# EAGLE design SPIDriverSRAM_v1 (EAGLE 9.6.2)
PC Engine Joypad Breakout Version 1.0
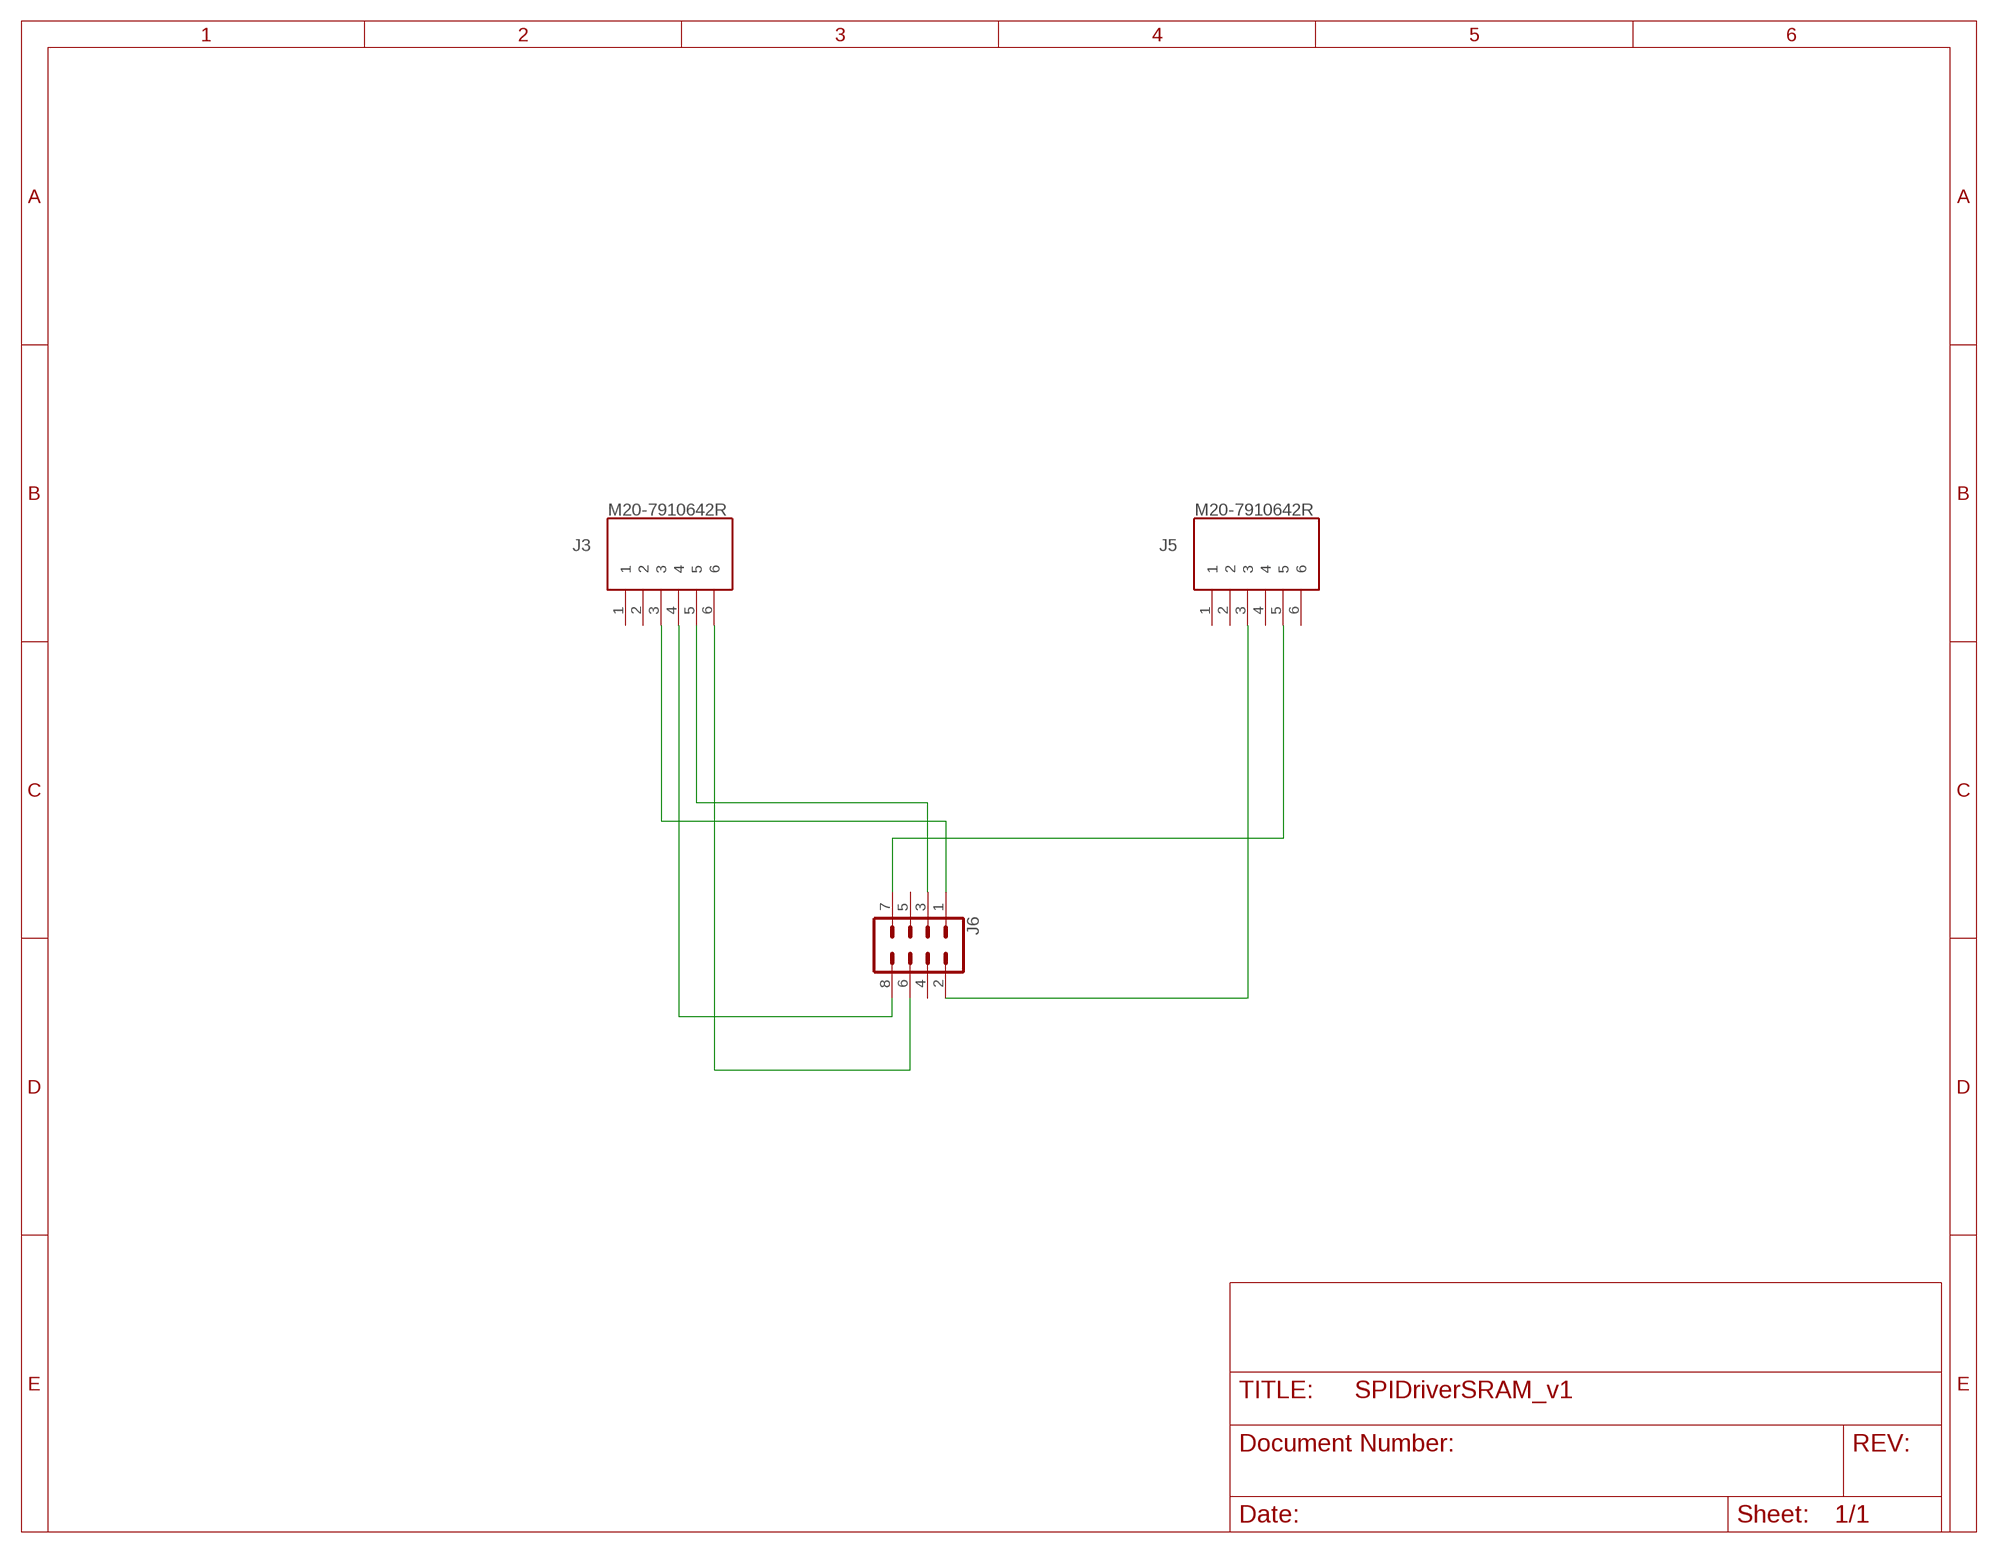
[diagram p0: schematic, sheet 1]

## Parts
J3  M20-7910642R  [M20-7910642R]
J5  M20-7910642R  [M20-7910642R]
J6  CONN_04X2  [2X4]

## Nets
N$1: J3.3 J6.1
N$2: J3.5 J6.3
N$3: J5.5 J6.7
N$4: J5.3 J6.2
N$5: J3.4 J6.8
N$6: J3.6 J6.6
Unconnected: J3.1 J3.2 J5.1 J5.2 J5.4 J5.6 J6.4 J6.5

## Library data of the parts
J3 J5 = PC-Engine:M20-7910642R: Headers & Wire Housings 6 WAY SIL HORIZ SMT SKT T&R Source: Datasheet <https://cdn.harwin.com/pdfs/M20-791R.pdf>; ARROW_PART_NUMBER: M20-7910642R; DESCRIPTION: Headers & Wire Housings 6 WAY SIL HORIZ SMT SKT T&R; HEIGHT: mm; MANUFACTURER_NAME: HARWIN; MANUFACTURER_PART_NUMBER: M20-7910642R; MOUSER_PART_NUMBER: 855-M20-7910642R; MOUSER_PRICE-STOCK: https://www.mouser.co.uk/ProductDetail/Harwin/M20-7910642R?qs=k41KVqW3ymovSPRowkWy%2Fg%3D%3D
J6 = SparkFun-Connectors:CONN_04X2: Multi connection point. Often used as Generic Header-pin footprint for 0.1 inch spaced/style header connections On any of the 0.1 inch spaced packages, you can populate with these: Break Away Headers - Straight <https://www.sparkfun.com/products/116> (PRT-00116) Break Away Male Headers - Right Angle <https://www.sparkfun.com/products/553> (PRT-00553) Female Headers <https://www.sparkfun.com/products/115> (PRT-00115) Break Away Headers - Machine Pin <https://www.sparkfun.com/products/117> (PRT-00117) Break Away Female Headers - Swiss Machine Pin <https://www.sparkfun.com/products/743> (PRT-00743)

## Net classes
0 default: width 0.305 mm, drill 0.356 mm, clearance 0.305 mm
1 breadboard: width 1.016 mm, drill 0.356 mm, clearance 0.305 mm
2 power: width 0.305 mm, drill 0.356 mm, clearance 0.305 mm
3 signal: width 0.152 mm, drill 0.356 mm, clearance 0.152 mm

## Board
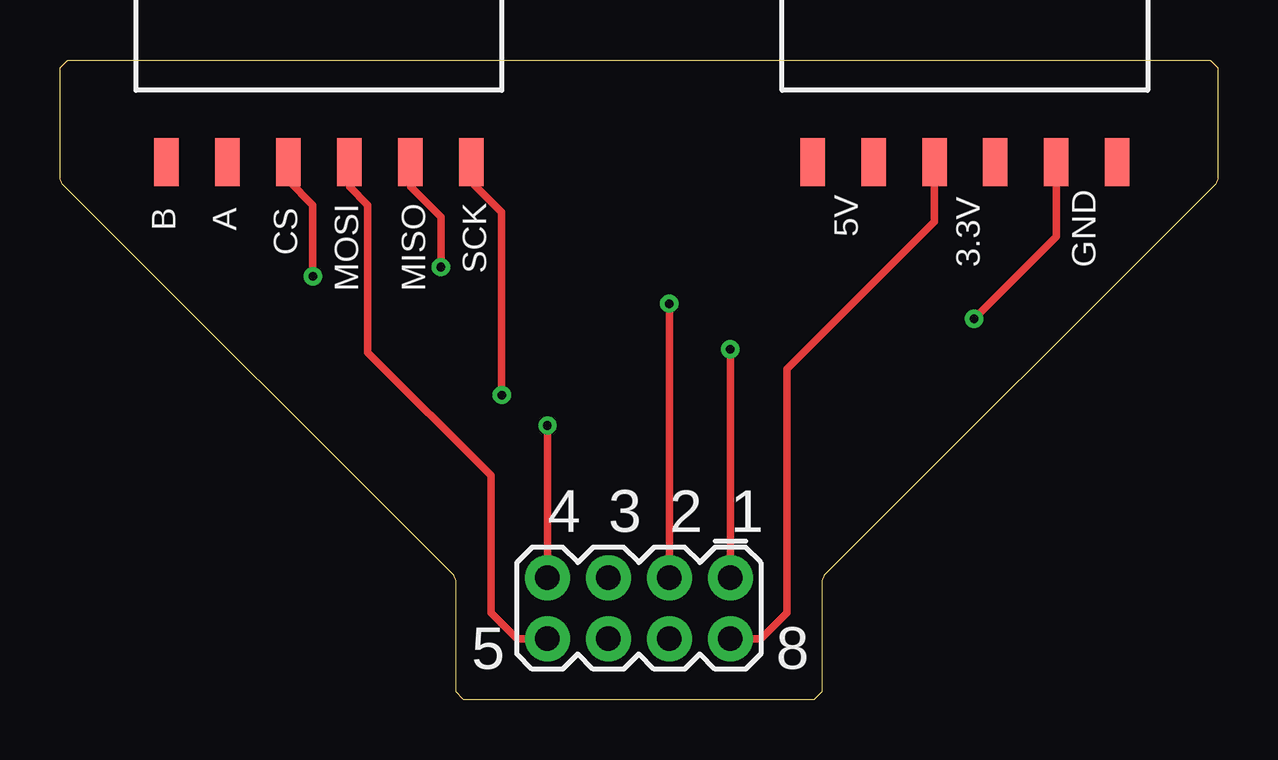
[diagram p1: board, top side]
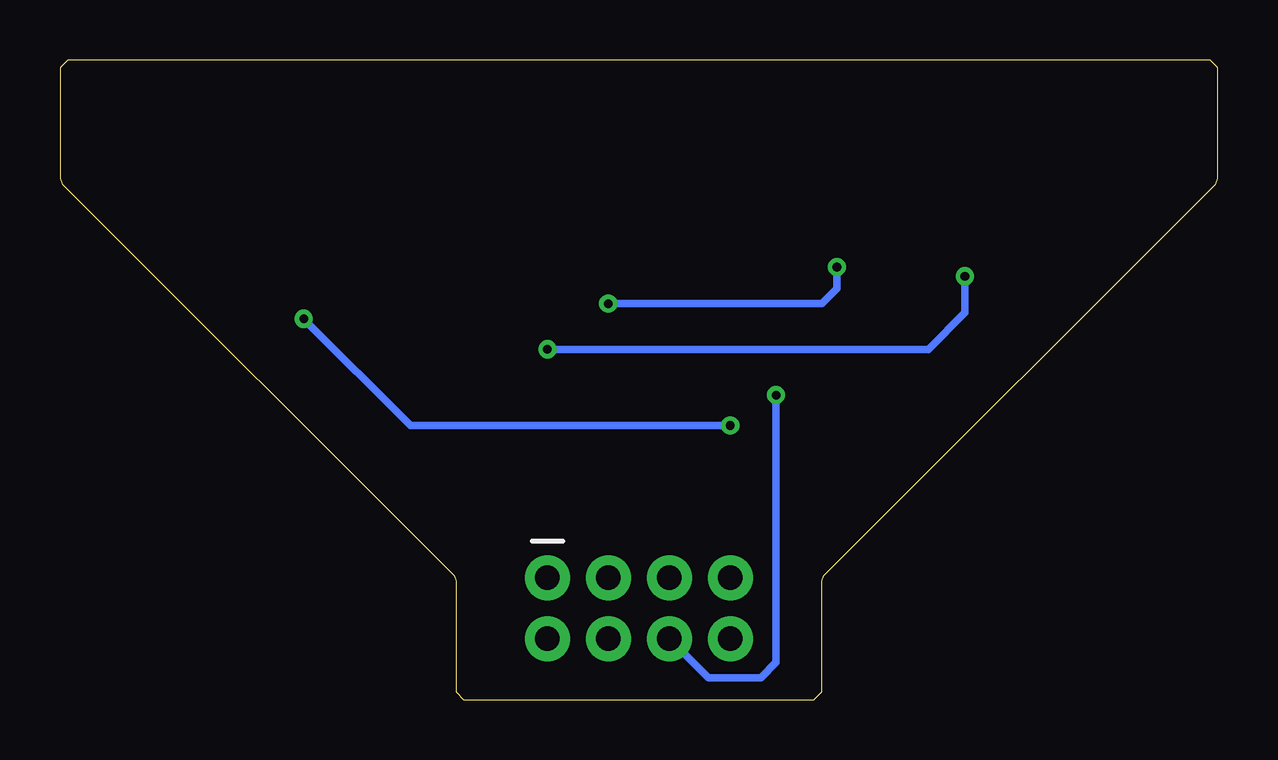
[diagram p2: board, bottom side, seen from below]

Size 48.26 x 26.67 mm. Coordinates in mm from the lower left corner, seen from the top.
Outline: 0,21.72 0,26.35 0.32,26.67 47.94,26.67 48.26,26.35 48.26,21.72 48.17,21.5 31.84,5.17 31.75,4.95 31.75,0.32 31.43,0 16.83,0 16.51,0.32 16.51,4.95 16.42,5.17 0.09,21.5 0,21.72
Copper layers (1*16): Top 0.035mm / dielectric 1.5mm / Bottom 0.035mm
Design rules "default *": minimum track width 6mil, minimum drill 0.35mm, track to track 6mil, track to pad 6mil, pad to pad 6mil, via to via 6mil, smd to smd 6mil, copper to edge 30mil, drill to drill 6mil, minimum pad ring 10mil, minimum via ring 8mil, stop-mask expansion 4mil, vias tented up to drill 15mil, thermal gap 10mil

### Footprints (pad centres in the part's own frame; a part is rotated, then mirrored left to right if it is on the bottom)
M20-7910642R = smd 1.02 x 2: 1 -6.35,-3; 2 -3.81,-3; 3 -1.27,-3; 4 1.27,-3; 5 3.81,-3; 6 6.35,-3
2X4 = drill 1.016 pad 1.88: 1 -3.81,-1.27; 2 -3.81,1.27; 3 -1.27,-1.27; 4 -1.27,1.27; 5 1.27,-1.27; 6 1.27,1.27; 7 3.81,-1.27; 8 3.81,1.27

### Placement (x,y rotation side)
J3  10.79,25.4 0 top
J5  37.72,25.4 0 top
J6  24.13,3.81 180 top

### Tracks (layer width: path | path; a pad name or v marks a point on that pad's centre or on a via)
N$1  (via drill 0.36)
  Top 0.305: J6.1 v27.94,14.61 | J3.3 9.53,21.64 10.54,20.62 v10.54,17.65
  Bottom 0.305: v10.54,17.65 10.54,16.13 12.06,14.61 v27.94,14.61
N$2  (via drill 0.36)
  Top 0.305: J6.3 v25.4,16.51 | J3.5 14.61,21.38 15.88,20.11 v15.88,18.03
  Bottom 0.305: v15.88,18.03 15.88,17.14 16.51,16.51 v25.4,16.51
N$3  (via drill 0.36)
  Top 0.305: J6.7 v20.32,11.43 | J5.5 41.53,19.3 v38.1,15.88
  Bottom 0.305: v20.32,11.43 33.66,11.43 v38.1,15.88
N$4
  Top 0.305: J6.2 29.21,2.54 30.29,3.62 30.29,13.78 36.45,19.94 J5.3
N$5
  Top 0.305: J6.8 19.05,2.54 17.97,3.62 17.97,9.34 12.83,14.48 12.83,20.62 12.06,21.38 J3.4
N$6  (via drill 0.36)
  Top 0.305: v18.41,12.7 18.41,20.32 17.14,21.59 J3.6
  Bottom 0.305: J6.6 21.23,0.91 19.05,0.91 18.41,1.55 v18.41,12.7

### Text on the board
tNames: B | A | CS | 5V | SCK | 3.3V | GND | MOSI | MISO | 4 | 3 | 2 | 1 | 5 | 8